# EAGLE design digitizer (EAGLE 8.0.1)

## Sheet 1 of 2
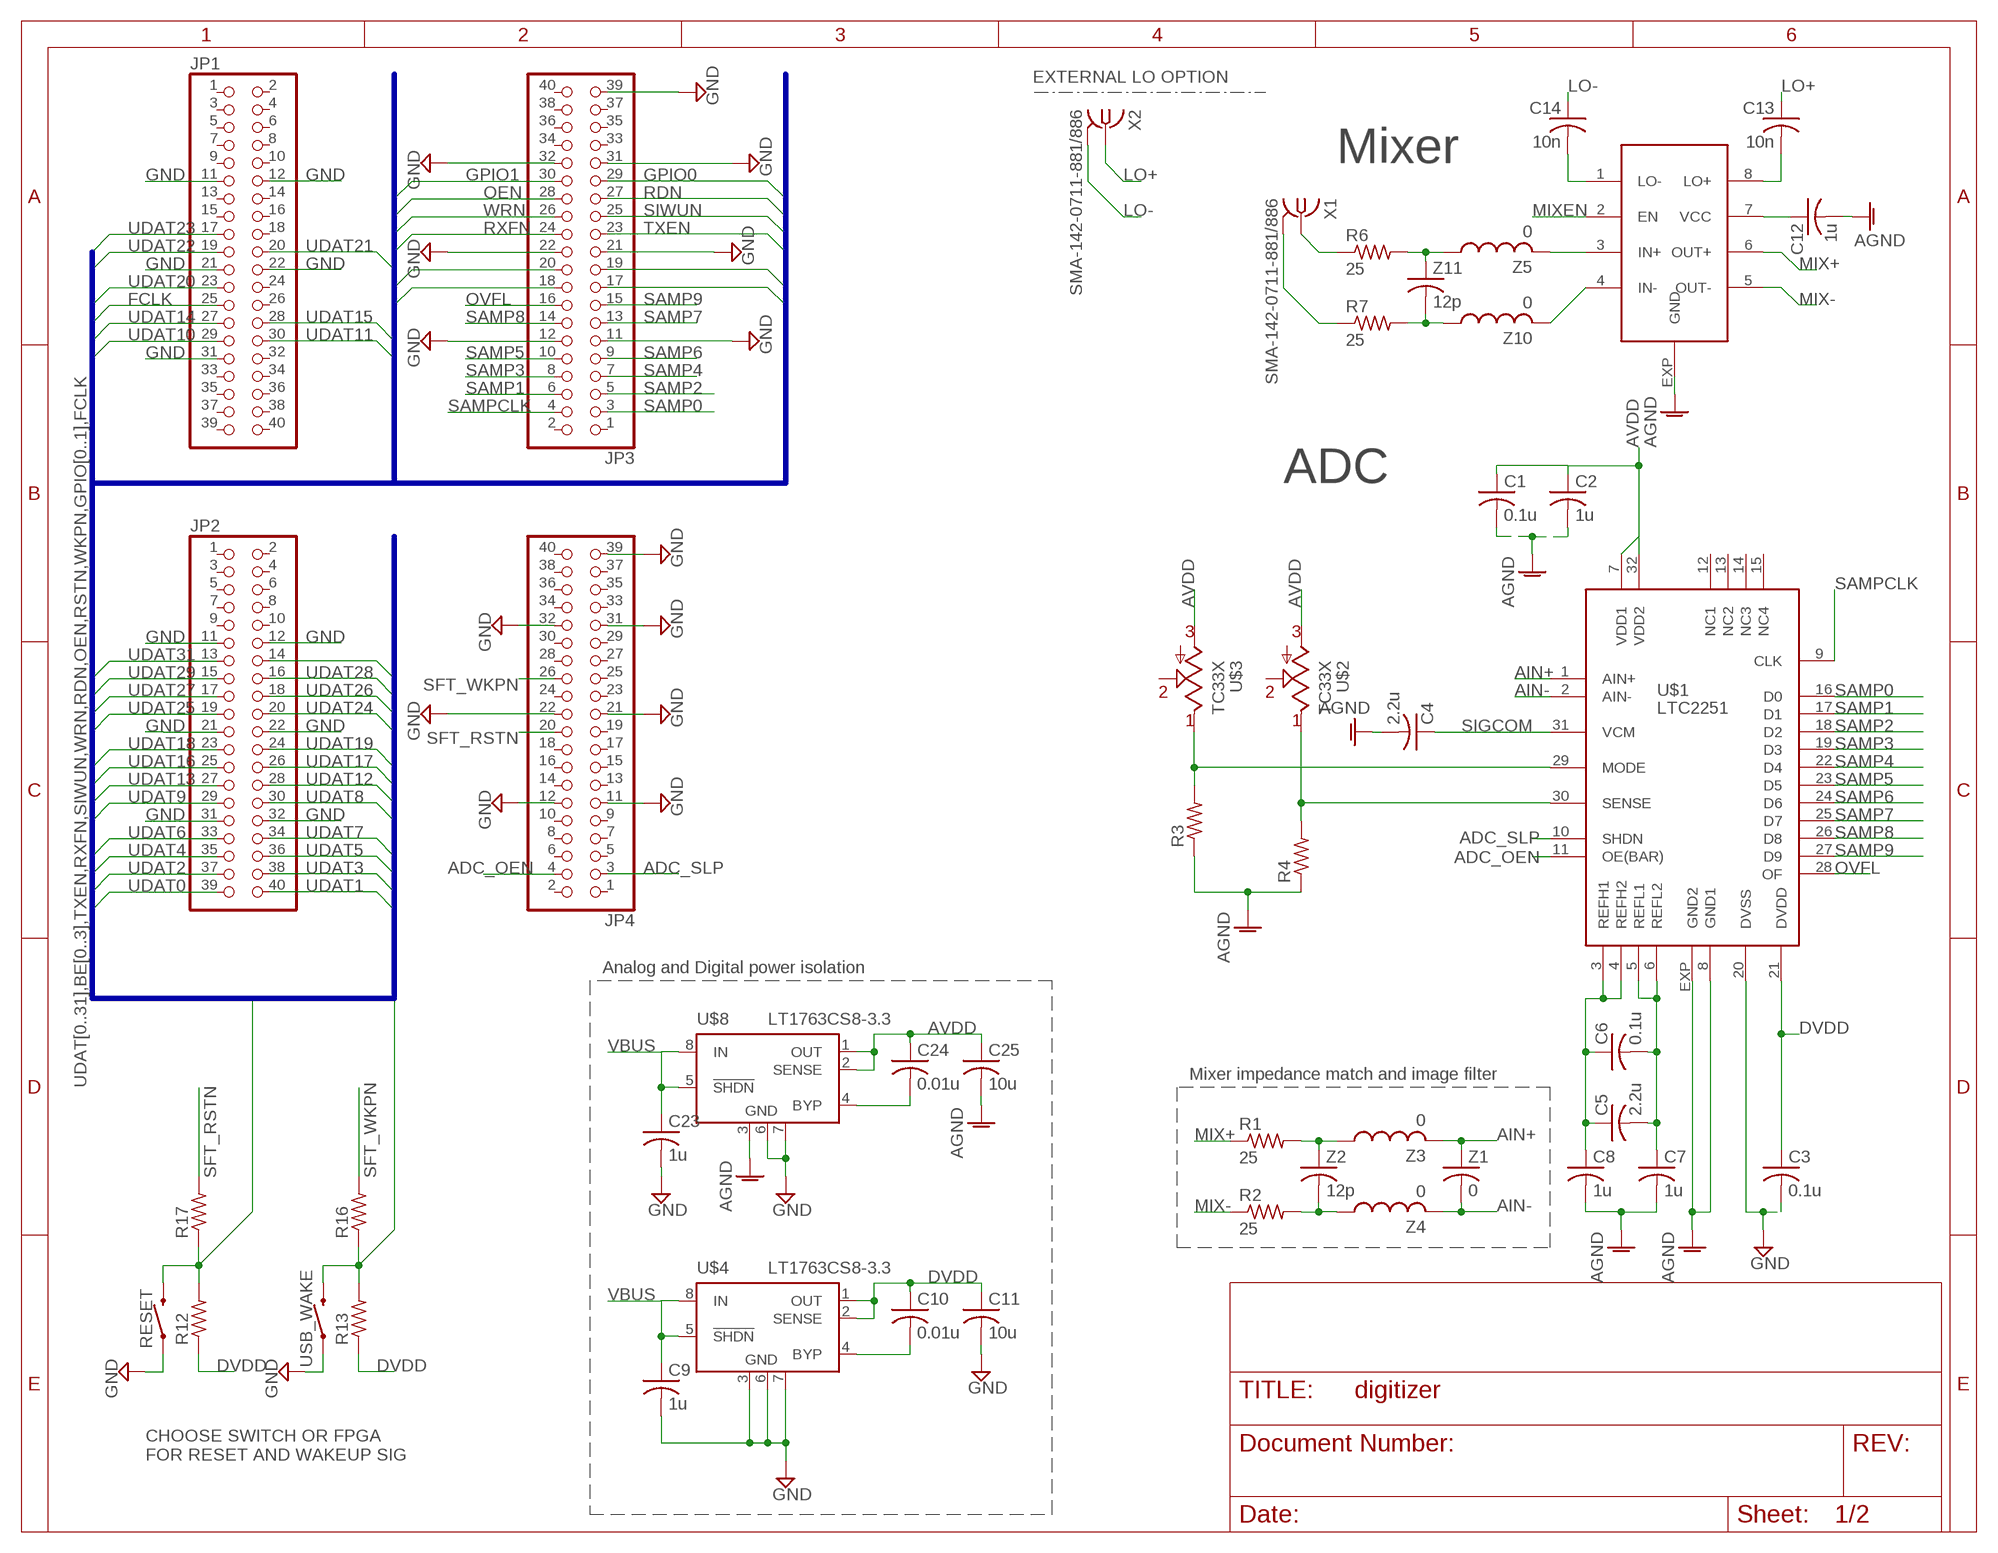
[diagram p0: schematic, sheet 1]

### Parts
C1  0.1u  C-USC0402  [C0402]
C2  1u  C-USC0402  [C0402]
C3  0.1u  C-USC0402  [C0402]
C4  2.2u  C-USC0402  [C0402]
C5  2.2u  C-USC0402  [C0402]
C6  0.1u  C-USC0402  [C0402]
C7  1u  C-USC0402  [C0402]
C8  1u  C-USC0402  [C0402]
C9  1u  C-USC0402  [C0402]
C10  0.01u  C-USC0402  [C0402]
C11  10u  C-USC0402  [C0402]
C12  1u  C-USC0402  [C0402]
C13  10n  C-USC0402  [C0402]
C14  10n  C-USC0402  [C0402]
C23  1u  C-USC0402  [C0402]
C24  0.01u  C-USC0402  [C0402]
C25  10u  C-USC0402  [C0402]
JP1  PINHD-2X20  [2X20]
JP2  PINHD-2X20  [2X20]
JP3  PINHD-2X20  [2X20]
JP4  PINHD-2X20  [2X20]
R1  25  R-US_R0402  [R0402]
R2  25  R-US_R0402  [R0402]
R3  R-US_R0402  [R0402]
R4  R-US_R0402  [R0402]
R6  25  R-US_R0402  [R0402]
R7  25  R-US_R0402  [R0402]
R12  R-US_R0402  [R0402]
R13  R-US_R0402  [R0402]
R16  R-US_R0402  [R0402]
R17  R-US_R0402  [R0402]
RESET  MOMENTARY-SWITCH-SPST-SMD-6.0X3.5MM  [TACTILE_SWITCH_SMD_6.0X3.5MM]
U$1  LTC2251  [HVQFN32]
U$2  TC33X  [SC59-POT]
U$3  TC33X  [SC59-POT]
U$4  LT1763CS8-3.3  [SOIC8]
U$5  LT5560  [DFN8-3X3]
U$8  LT1763CS8-3.3  [SOIC8]
USB_WAKE  MOMENTARY-SWITCH-SPST-SMD-6.0X3.5MM  [TACTILE_SWITCH_SMD_6.0X3.5MM]
X1  SMA-142-0711-881/886  [J502-ND-142-0711-881/886]
X2  SMA-142-0711-881/886  [J502-ND-142-0711-881/886]
Z1  0  C-USC0402  [C0402]
Z2  12p  C-USC0402  [C0402]
Z3  0  L-US0402  [R0402]
Z4  0  L-US0402  [R0402]
Z5  0  L-US0402  [R0402]
Z10  0  L-US0402  [R0402]
Z11  12p  C-USC0402  [C0402]

### Nets
ADC_OEN: JP4.4 U$1.11(OE(BAR))
ADC_SLP: JP4.3 U$1.10(SHDN)
AGND: C1.2 C2.2 C4.2 C7.2 C8.2 C12.2 C25.2 R3.1 R4.1 U$1.8(GND1) U$1.EXP(GND2) U$5.EXP(GND) U$8.3(GND)
AIN+: U$1.1(AIN+) Z1.1 Z3.2
AIN-: U$1.2(AIN-) Z1.2 Z4.2
AVDD: C1.1 C2.1 C24.1 C25.1 U$1.7(VDD1) U$1.32(VDD2) U$2.3 U$3.3 U$8.1(OUT) U$8.2(SENSE)
BE0: JP3.18 ; also sheet 2
BE1: JP3.17 ; also sheet 2
BE2: JP3.20 ; also sheet 2
BE3: JP3.19 ; also sheet 2
DVDD: C3.1 C10.1 C11.1 R12.1 R13.1 U$1.21(DVDD) U$4.1(OUT) U$4.2(SENSE) ; also sheet 2
FCLK: JP1.25 ; also sheet 2
GND: C3.2 C9.2 C11.2 C23.2 JP1.11 JP1.12 JP1.21 JP1.22 JP1.31 JP2.11 JP2.12 JP2.21 JP2.22 JP2.31 JP2.32 JP3.11 JP3.12 JP3.21 JP3.22 JP3.31 JP3.32 JP3.39 JP4.11 JP4.12 JP4.21 JP4.22 JP4.31 JP4.32 RESET.1 U$1.20(DVSS) U$4.3(GND) U$4.6(GND) U$4.7(GND) U$8.6(GND) U$8.7(GND) USB_WAKE.1 ; also sheet 2
GPIO0: JP3.29 ; also sheet 2
GPIO1: JP3.30 ; also sheet 2
LO+: C13.1 X2.1
LO-: C14.1 X2.G@1 X2.G@2 X2.G@3 X2.G@4
MIX+: R1.1 U$5.6(OUT+)
MIX-: R2.1 U$5.5(OUT-)
MIXEN: U$5.2(EN)
N$1: R7.1 X1.G@1 X1.G@2 X1.G@3 X1.G@4
N$2: C5.1 C6.1 C8.1 U$1.3(REFH1) U$1.4(REFH2)
N$3: C5.2 C6.2 C7.1 U$1.5(REFL1) U$1.6(REFL2)
N$4: R3.2 U$1.29(MODE) U$3.1
N$5: R4.2 U$1.30(SENSE) U$2.1
N$6: R1.2 Z2.1 Z3.1
N$7: R2.2 Z2.2 Z4.1
N$9: C10.2 U$4.4(BYP)
N$10: R6.1 X1.1
N$16: C24.2 U$8.4(BYP)
N$20: C12.1 U$5.7(VCC)
N$21: C14.2 U$5.1(LO-)
N$22: C13.2 U$5.8(LO+)
N$23: R6.2 Z5.1 Z11.1
N$24: U$5.3(IN+) Z5.2
N$25: U$5.4(IN-) Z10.2
N$26: R7.2 Z10.1 Z11.2
OEN: JP3.28 ; also sheet 2
OVFL: JP3.16 U$1.28(OF)
RDN: JP3.27 ; also sheet 2
RSTN: R12.2 R17.1 RESET.2 ; also sheet 2
RXFN: JP3.24 ; also sheet 2
SAMP0: JP3.3 U$1.16(D0)
SAMP1: JP3.6 U$1.17(D1)
SAMP2: JP3.5 U$1.18(D2)
SAMP3: JP3.8 U$1.19(D3)
SAMP4: JP3.7 U$1.22(D4)
SAMP5: JP3.10 U$1.23(D5)
SAMP6: JP3.9 U$1.24(D6)
SAMP7: JP3.13 U$1.25(D7)
SAMP8: JP3.14 U$1.26(D8)
SAMP9: JP3.15 U$1.27(D9)
SAMPCLK: JP3.4 U$1.9(CLK)
SFT_RSTN: JP4.20 R17.2
SFT_WKPN: JP4.26 R16.2
SIGCOM: C4.1 U$1.31(VCM)
SIWUN: JP3.25 ; also sheet 2
TXEN: JP3.23 ; also sheet 2
UDAT0: JP2.39 ; also sheet 2
UDAT1: JP2.40 ; also sheet 2
UDAT2: JP2.37 ; also sheet 2
UDAT3: JP2.38 ; also sheet 2
UDAT4: JP2.35 ; also sheet 2
UDAT5: JP2.36 ; also sheet 2
UDAT6: JP2.33 ; also sheet 2
UDAT7: JP2.34 ; also sheet 2
UDAT8: JP2.30 ; also sheet 2
UDAT9: JP2.29 ; also sheet 2
UDAT10: JP1.29 ; also sheet 2
UDAT11: JP1.30 ; also sheet 2
UDAT12: JP2.28 ; also sheet 2
UDAT13: JP2.27 ; also sheet 2
UDAT14: JP1.27 ; also sheet 2
UDAT15: JP1.28 ; also sheet 2
UDAT16: JP2.25 ; also sheet 2
UDAT17: JP2.26 ; also sheet 2
UDAT18: JP2.23 ; also sheet 2
UDAT19: JP2.24 ; also sheet 2
UDAT20: JP1.23 ; also sheet 2
UDAT21: JP1.20 ; also sheet 2
UDAT22: JP1.19 ; also sheet 2
UDAT23: JP1.17 ; also sheet 2
UDAT24: JP2.20 ; also sheet 2
UDAT25: JP2.19 ; also sheet 2
UDAT26: JP2.18 ; also sheet 2
UDAT27: JP2.17 ; also sheet 2
UDAT28: JP2.16 ; also sheet 2
UDAT29: JP2.15 ; also sheet 2
UDAT30: JP2.14 ; also sheet 2
UDAT31: JP2.13 ; also sheet 2
VBUS: C9.1 C23.1 U$4.5(!SHDN) U$4.8(IN) U$8.5(!SHDN) U$8.8(IN) ; also sheet 2
WKPN: R13.2 R16.1 USB_WAKE.2 ; also sheet 2
WRN: JP3.26 ; also sheet 2
Unconnected: JP1.1 JP1.2 JP1.3 JP1.4 JP1.5 JP1.6 JP1.7 JP1.8 JP1.9 JP1.10 JP1.13 JP1.14 JP1.15 JP1.16 JP1.18 JP1.24 JP1.26 JP1.32 JP1.33 JP1.34 JP1.35 JP1.36 JP1.37 JP1.38 JP1.39 JP1.40 JP2.1 JP2.2 JP2.3 JP2.4 JP2.5 JP2.6 JP2.7 JP2.8 JP2.9 JP2.10 JP3.1 JP3.2 JP3.33 JP3.34 JP3.35 JP3.36 JP3.37 JP3.38 JP3.40 JP4.1 JP4.2 JP4.5 JP4.6 JP4.7 JP4.8 JP4.9 JP4.10 JP4.13 JP4.14 JP4.15 JP4.16 JP4.17 JP4.18 JP4.19 JP4.23 JP4.24 JP4.25 JP4.27 JP4.28 JP4.29 JP4.30 JP4.33 JP4.34 JP4.35 JP4.36 JP4.37 JP4.38 JP4.39 JP4.40 U$1.12(NC1) U$1.13(NC2) U$1.14(NC3) U$1.15(NC4) U$2.2 U$3.2

### Buses
UDAT[0..31],BE[0..3],TXEN,RXFN,SIWUN,WRN,RDN,OEN,RSTN,WKPN,GPIO[0..1],FCLK

### Notes on the sheet
- EXTERNAL LO OPTION
- Mixer
- ADC
- Analog and Digital power isolation
- Mixer impedance match and image filter
- CHOOSE SWITCH OR FPGA
  FOR RESET AND WAKEUP SIG

## Sheet 2 of 2
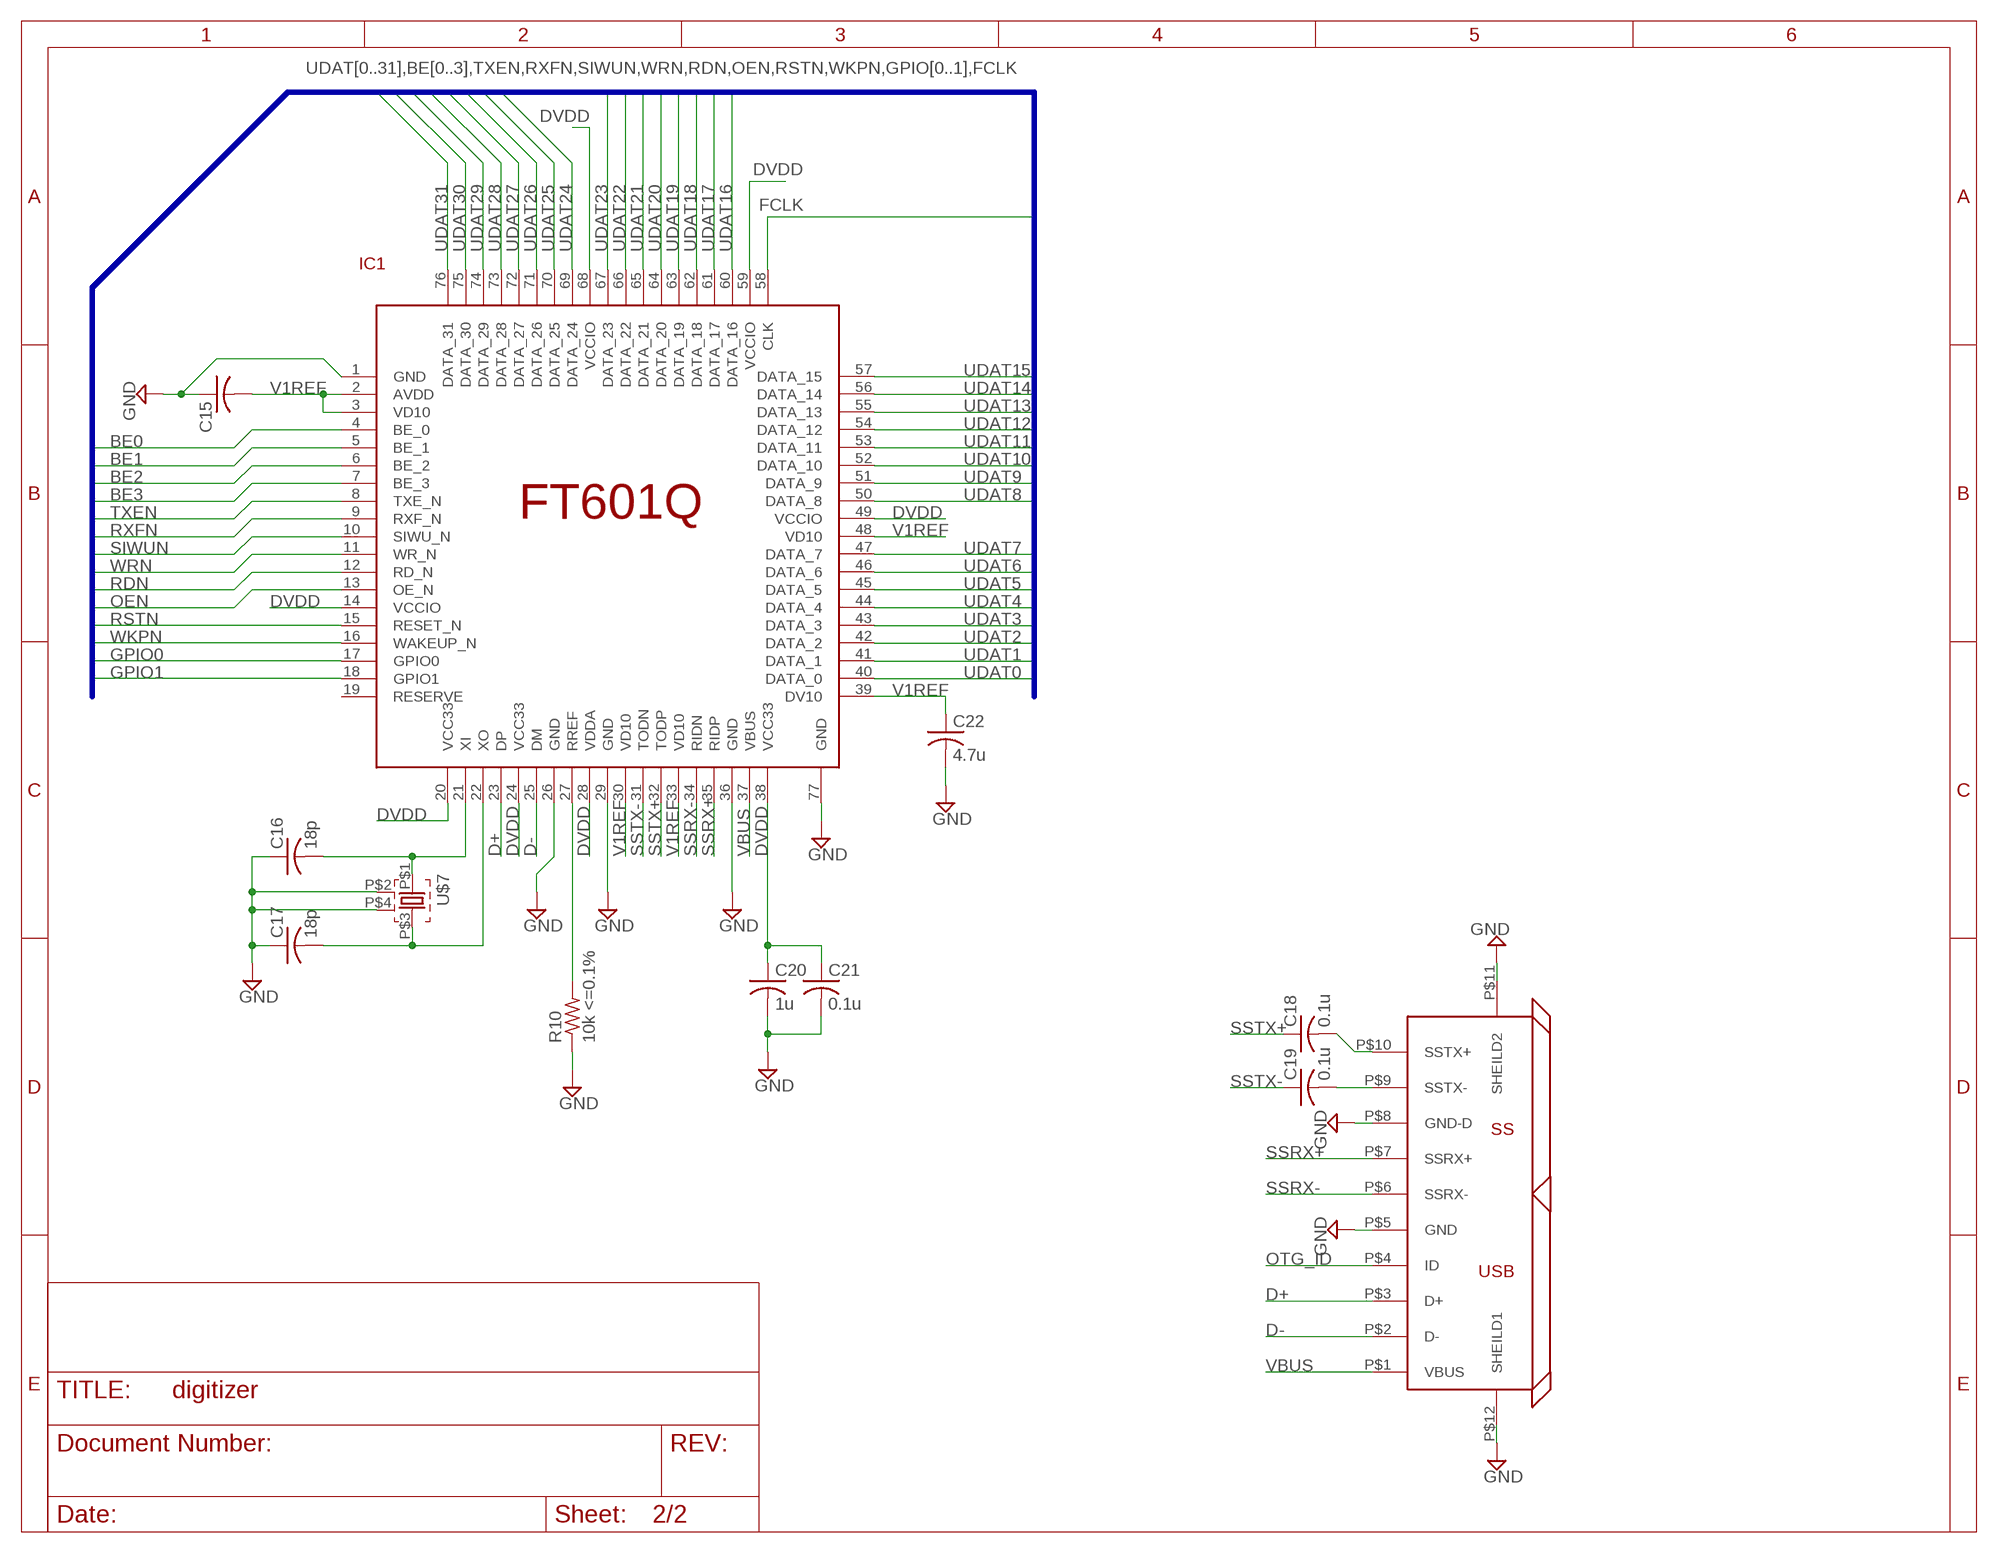
[diagram p1: schematic, sheet 2]

### Parts
C15  C-USC0402  [C0402]
C16  18p  C-USC0402  [C0402]
C17  18p  C-USC0402  [C0402]
C18  0.1u  C-USC0402  [C0402]
C19  0.1u  C-USC0402  [C0402]
C20  1u  C-USC0402  [C0402]
C21  0.1u  C-USC0402  [C0402]
C22  4.7u  C-USC0402  [C0402]
IC1  FT601QQFN76  [QFN76]
R10  10k <=0.1%  R-US_R0402  [R0402]
U$6  USB3.0  [USB-MICROB-3.0]
U$7  CX3225SB_UKY1C-H1-16357-0045  [UKY1C-H1-16357-0045]

### Nets
BE0: IC1.4(BE_0) ; also sheet 1
BE1: IC1.5(BE_1) ; also sheet 1
BE2: IC1.6(BE_2) ; also sheet 1
BE3: IC1.7(BE_3) ; also sheet 1
D+: IC1.23(DP) U$6.P$3(D+)
D-: IC1.25(DM) U$6.P$2(D-)
DVDD: C20.1 C21.1 IC1.14(VCCIO) IC1.20(VCC33) IC1.24(VCC33) IC1.28(VDDA) IC1.38(VCC33) IC1.49(VCCIO) IC1.59(VCCIO) IC1.68(VCCIO) ; also sheet 1
FCLK: IC1.58(CLK) ; also sheet 1
GND: C15.1 C16.1 C17.1 C20.2 C21.2 C22.2 IC1.1(GND) IC1.26(GND) IC1.29(GND) IC1.36(GND) IC1.77(GND) R10.1 U$6.P$5(GND) U$6.P$8(GND-D) U$6.P$11(SHEILD2) U$6.P$12(SHEILD1) U$7.P$2 U$7.P$4 ; also sheet 1
GPIO0: IC1.17(GPIO0) ; also sheet 1
GPIO1: IC1.18(GPIO1) ; also sheet 1
N$11: C16.2 IC1.21(XI) U$7.P$1
N$12: C17.2 IC1.22(XO) U$7.P$3
N$13: IC1.27(RREF) R10.2
N$14: C18.2 U$6.P$10(SSTX+)
N$15: C19.2 U$6.P$9(SSTX-)
OEN: IC1.13(OE_N) ; also sheet 1
OTG_ID: U$6.P$4(ID)
RDN: IC1.12(RD_N) ; also sheet 1
RSTN: IC1.15(RESET_N) ; also sheet 1
RXFN: IC1.9(RXF_N) ; also sheet 1
SIWUN: IC1.10(SIWU_N) ; also sheet 1
SSRX+: IC1.35(RIDP) U$6.P$7(SSRX+)
SSRX-: IC1.34(RIDN) U$6.P$6(SSRX-)
SSTX+: C18.1 IC1.32(TODP)
SSTX-: C19.1 IC1.31(TODN)
TXEN: IC1.8(TXE_N) ; also sheet 1
UDAT0: IC1.40(DATA_0) ; also sheet 1
UDAT1: IC1.41(DATA_1) ; also sheet 1
UDAT2: IC1.42(DATA_2) ; also sheet 1
UDAT3: IC1.43(DATA_3) ; also sheet 1
UDAT4: IC1.44(DATA_4) ; also sheet 1
UDAT5: IC1.45(DATA_5) ; also sheet 1
UDAT6: IC1.46(DATA_6) ; also sheet 1
UDAT7: IC1.47(DATA_7) ; also sheet 1
UDAT8: IC1.50(DATA_8) ; also sheet 1
UDAT9: IC1.51(DATA_9) ; also sheet 1
UDAT10: IC1.52(DATA_10) ; also sheet 1
UDAT11: IC1.53(DATA_11) ; also sheet 1
UDAT12: IC1.54(DATA_12) ; also sheet 1
UDAT13: IC1.55(DATA_13) ; also sheet 1
UDAT14: IC1.56(DATA_14) ; also sheet 1
UDAT15: IC1.57(DATA_15) ; also sheet 1
UDAT16: IC1.60(DATA_16) ; also sheet 1
UDAT17: IC1.61(DATA_17) ; also sheet 1
UDAT18: IC1.62(DATA_18) ; also sheet 1
UDAT19: IC1.63(DATA_19) ; also sheet 1
UDAT20: IC1.64(DATA_20) ; also sheet 1
UDAT21: IC1.65(DATA_21) ; also sheet 1
UDAT22: IC1.66(DATA_22) ; also sheet 1
UDAT23: IC1.67(DATA_23) ; also sheet 1
UDAT24: IC1.69(DATA_24) ; also sheet 1
UDAT25: IC1.70(DATA_25) ; also sheet 1
UDAT26: IC1.71(DATA_26) ; also sheet 1
UDAT27: IC1.72(DATA_27) ; also sheet 1
UDAT28: IC1.73(DATA_28) ; also sheet 1
UDAT29: IC1.74(DATA_29) ; also sheet 1
UDAT30: IC1.75(DATA_30) ; also sheet 1
UDAT31: IC1.76(DATA_31) ; also sheet 1
V1REF: C15.2 C22.1 IC1.2(AVDD) IC1.3(VD10) IC1.30(VD10) IC1.33(VD10) IC1.39(DV10) IC1.48(VD10)
VBUS: IC1.37(VBUS) U$6.P$1(VBUS) ; also sheet 1
WKPN: IC1.16(WAKEUP_N) ; also sheet 1
WRN: IC1.11(WR_N) ; also sheet 1
Unconnected: IC1.19(RESERVE)

### Buses
UDAT[0..31],BE[0..3],TXEN,RXFN,SIWUN,WRN,RDN,OEN,RSTN,WKPN,GPIO[0..1],FCLK

## Library data of the parts
C1-C14 C16-C25 Z1 Z2 Z11 = resistor:C-US: CAPACITOR, American symbol
C15 = rcl:C-US: CAPACITOR, American symbol
IC1 = lt_ftdi_and_more:FT601Q
JP1-JP4 = pinhead:PINHD-2X20: PIN HEADER
R1-R4 R6 R7 R10 R12 R13 R16 R17 = resistor:R-US_: RESISTOR, American symbol
RESET USB_WAKE = SparkFun-Switches:MOMENTARY-SWITCH-SPST: Momentary Switch (Pushbutton) - SPST Normally-open (NO) SPST momentary switches (buttons, pushbuttons). Variants PTH-12MM - 12mm square, through-hole Momentary Pushbutton Switch - 12mm Square <https://www.sparkfun.com/products/9190> (COM-09190) PTH-6.0MM, PTH-6.0MM-KIT - 6.0mm square, through-hole Mini Pushbutton Switch <https://www.sparkfun.com/products/97> (COM-00097) KIT package intended for soldering kit's - only one side of pads' copper is exposed. PTH-RIGHT-ANGLE-KIT - Right-angle, through-hole Right Angle Tactile Button <https://www.sparkfun.com/products/10791> - Used on SparkFun BigTime Watch Kit <https://www.sparkfun.com/products/11734> SMD-12MM - 12mm square, surface-mount Tactile Button - SMD (12mm) <https://www.sparkfun.com/products/12993> (COM-12993) Used on SparkFun PicoBoard <https://www.sparkfun.com/products/11888> SMD-4.5MM - 4.5mm Square Trackball Switch Used on SparkFun Blackberry Trackballer Breakout <https://www.sparkfun.com/products/13169> SMD-4.6MMX2.8MM - 4.60mm x 2.80mm, surface mount Used on SparkFun SAMD21 Mini Breakout <https://www.sparkfun.com/products/13664> SMD-5.2MM, SMD-5.2-REDUNDANT - 5.2mm square, surface-mount Mini Pushbutton Switch - SMD <https://www.sparkfun.com/products/8720> (COM-08720) Used on Arduino Pro Mini <https://www.sparkfun.com/products/11114> REDUNDANT package connects both switch circuits together SMD-6.0X3.5MM - 6.0 x 3.5mm, surface mount Momentary Reset Switch SMD <https://www.sparkfun.com/products/8229> (COM-08229) SMD-6.2MM-TALL - 6.2mm square, surface mount Tactile Button - SMD (6mm) <https://www.sparkfun.com/products/12992> Used on SparkFun Digital Sandbox <https://www.sparkfun.com/products/12651> SMD-RIGHT-ANGLE - Right-angle, surface mount Used on SparkFun Block for Intel® Edison - Arduino <https://www.sparkfun.com/products/13036>; PROD_ID: SWCH-00815; SF_SKU: COM-08229
U$1 = components:LTC2251: LTC2251 125MSPS Pipelined ADC
U$2 U$3 = components:TC33X: Wiper pots
U$4 U$8 = linear-technology:LT1763CS8: 500mA, Low Noise, LDO Micropower Regulators Source: http://cds.linear.com/docs/Datasheet/1763ff.pdf; MPN: LT1763CS8-3.3; OC_FARNELL: 1273617; OC_NEWARK: 57M6055
U$5 = components:LT5560
U$6 = components:USB3.0
U$7 = components:CX3225SB_UKY1C-H1-16357-0045
X1 X2 = con-coax:SMA-: SMA 50 Ohm End Launch Jack Receptacle - Round Contact Johnson Components Source: www.johnsoncomponents.com .. J502-ND.pdf; MF: JOHNSON COMPONENTS; MPN: 142-0711-881; OC_FARNELL: unknown; OC_NEWARK: 50B4464
Z3-Z5 Z10 = components:L-US

## Board
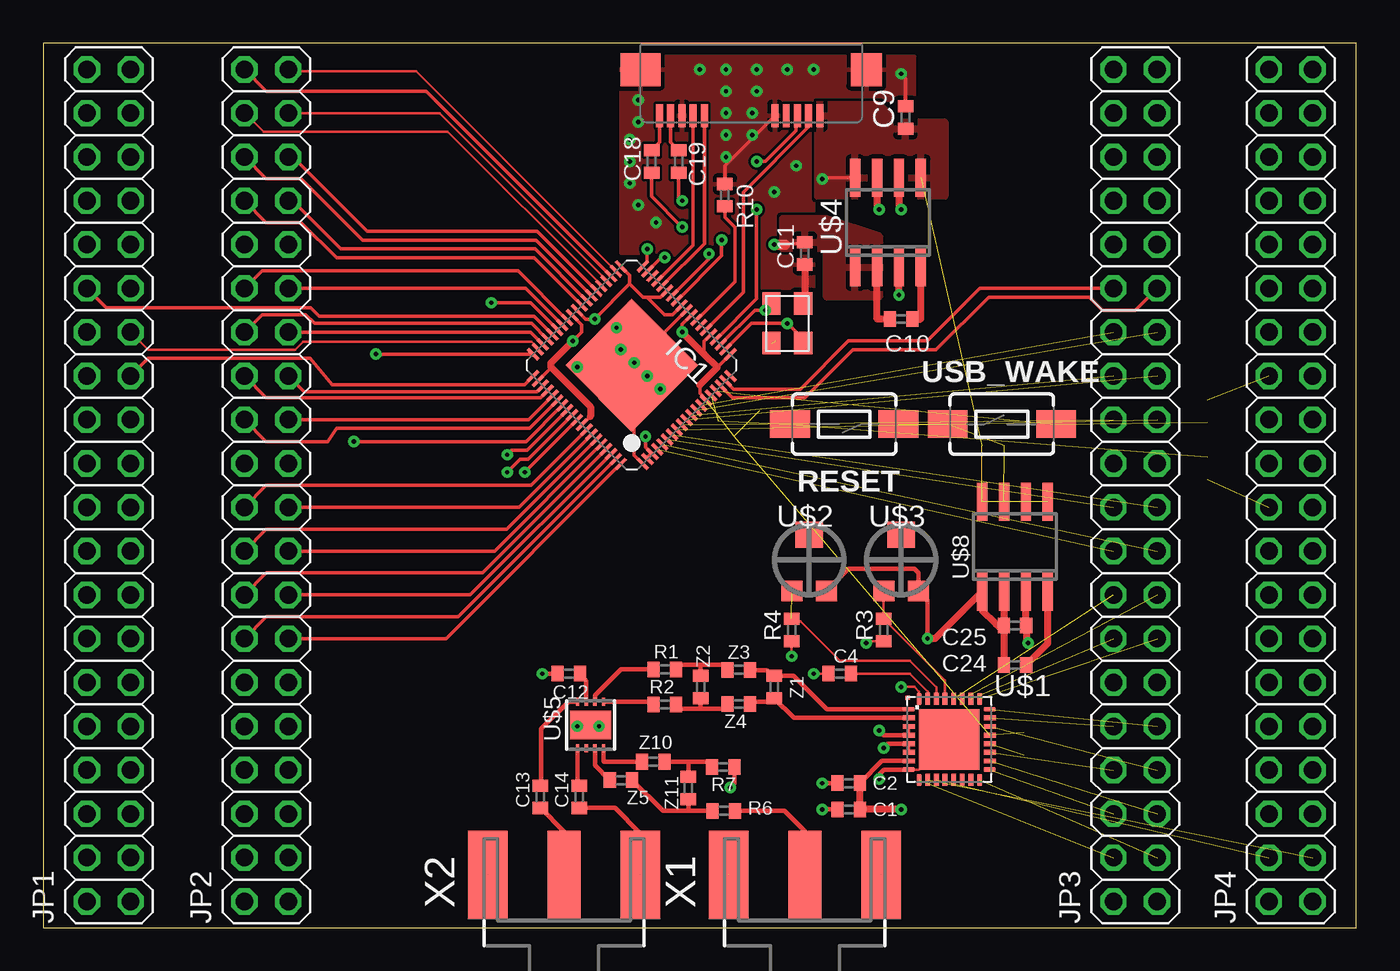
[diagram p2: board, top side]
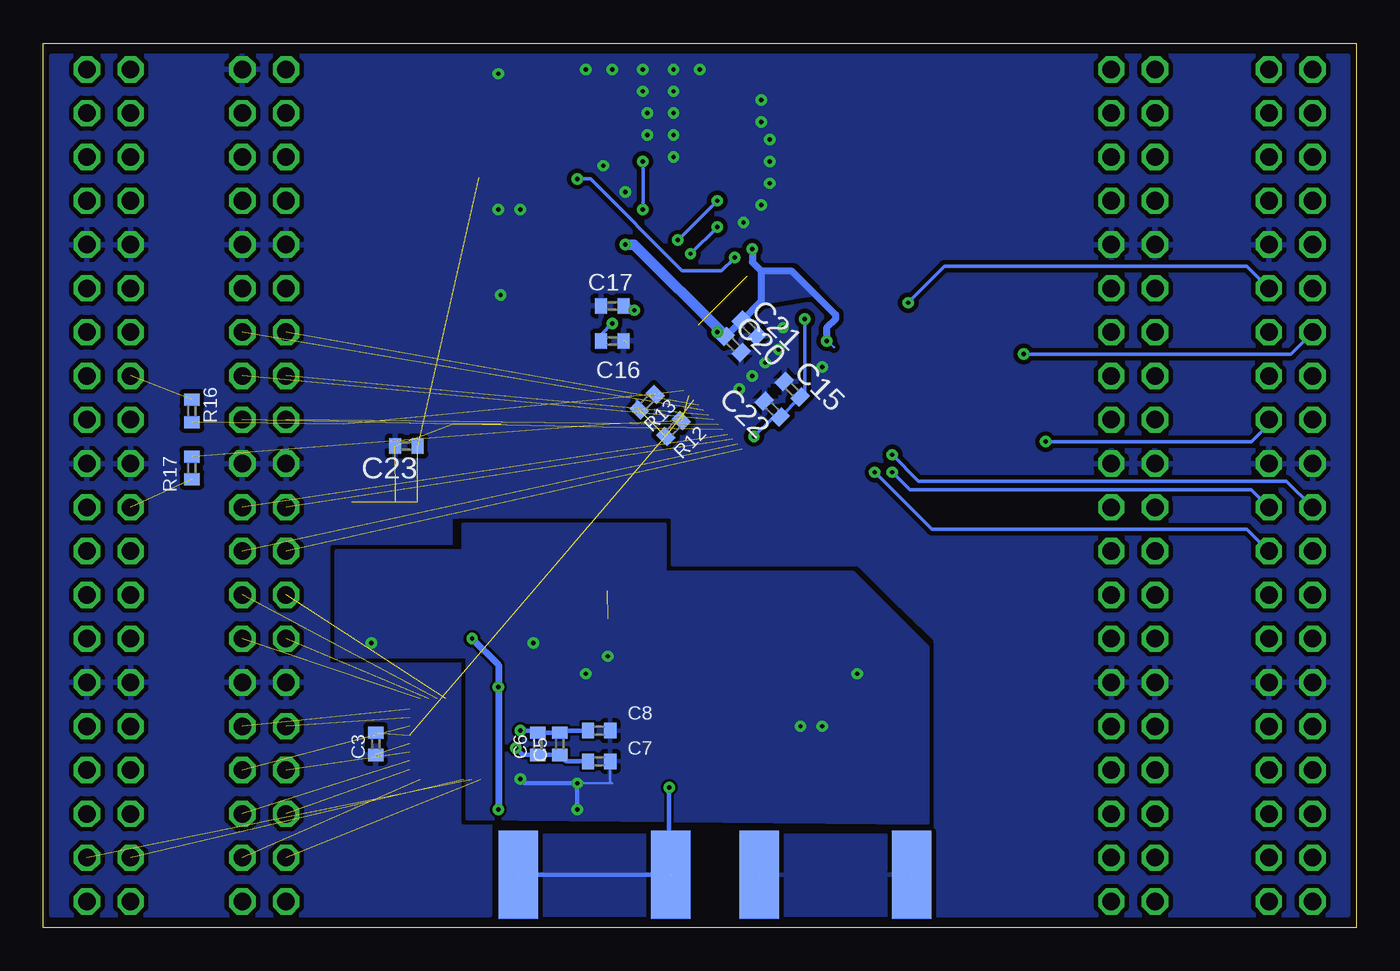
[diagram p3: board, bottom side, seen from below]

Size 76.2 x 51.31 mm. Coordinates in mm from the lower left corner, seen from the top.
Outline: 0,0 76.2,0 76.2,51.31 0,51.31 0,0
Copper layers (1*16): Top 0.035mm / dielectric 1.5mm / Bottom 0.035mm
Design rules "default *": minimum track width 6mil, minimum drill 10mil, track to track 6mil, track to pad 6mil, pad to pad 6mil, via to via 6mil, smd to smd 6mil, copper to edge 12mil, drill to drill 12mil, minimum pad ring 8mil, minimum via ring 8mil, stop-mask expansion 4mil, vias tented up to drill 0mil, thermal gap 10mil

### Footprints (pad centres in the part's own frame; a part is rotated, then mirrored left to right if it is on the bottom)
C0402 = smd 0.7 x 0.9: 1 -0.65,0; 2 0.65,0
QFN76 = smd 0.84 x 0.203: 1 -4.5,3.598; 2 -4.5,3.198; 3 -4.5,2.798; 4 -4.5,2.398; 5 -4.5,1.998; 6 -4.5,1.598; 7 -4.5,1.198; 8 -4.5,0.798; 9 -4.5,0.398; 10 -4.5,-0.002; 11 -4.5,-0.402; 12 -4.5,-0.802; 13 -4.5,-1.202; 14 -4.5,-1.602; 15 -4.5,-2.002; 16 -4.5,-2.402; 17 -4.5,-2.802; 18 -4.5,-3.202; 19 -4.5,-3.602; 39 4.5,-3.602; 40 4.5,-3.202; 41 4.5,-2.802; 42 4.5,-2.402; 43 4.5,-2.002; 44 4.5,-1.602; 45 4.5,-1.202; 46 4.5,-0.802; 47 4.5,-0.402; 48 4.5,-0.002; 49 4.5,0.398; 50 4.5,0.798; 51 4.5,1.198; 52 4.5,1.598; 53 4.5,1.998; 54 4.5,2.398; 55 4.5,2.798; 56 4.5,3.198; 57 4.5,3.598 | smd 0.203 x 0.84: 20 -3.598,-4.5; 21 -3.198,-4.5; 22 -2.798,-4.5; 23 -2.398,-4.5; 24 -1.998,-4.5; 25 -1.598,-4.5; 26 -1.198,-4.5; 27 -0.798,-4.5; 28 -0.398,-4.5; 29 0.002,-4.5; 30 0.402,-4.5; 31 0.802,-4.5; 32 1.202,-4.5; 33 1.602,-4.5; 34 2.002,-4.5; 35 2.402,-4.5; 36 2.802,-4.5; 37 3.202,-4.5; 38 3.602,-4.5; 58 3.602,4.5; 59 3.202,4.5; 60 2.802,4.5; 61 2.402,4.5; 62 2.002,4.5; 63 1.602,4.5; 64 1.202,4.5; 65 0.802,4.5; 66 0.402,4.5; 67 0.002,4.5; 68 -0.398,4.5; 69 -0.798,4.5; 70 -1.198,4.5; 71 -1.598,4.5; 72 -1.998,4.5; 73 -2.398,4.5; 74 -2.798,4.5; 75 -3.198,4.5; 76 -3.598,4.5 | smd 5.45 x 5.45: 77 0,0
2X20 = drill 1.016 octagon: 1 -24.13,-1.27; 2 -24.13,1.27; 3 -21.59,-1.27; 4 -21.59,1.27; 5 -19.05,-1.27; 6 -19.05,1.27; 7 -16.51,-1.27; 8 -16.51,1.27; 9 -13.97,-1.27; 10 -13.97,1.27; 11 -11.43,-1.27; 12 -11.43,1.27; 13 -8.89,-1.27; 14 -8.89,1.27; 15 -6.35,-1.27; 16 -6.35,1.27; 17 -3.81,-1.27; 18 -3.81,1.27; 19 -1.27,-1.27; 20 -1.27,1.27; 21 1.27,-1.27; 22 1.27,1.27; 23 3.81,-1.27; 24 3.81,1.27; 25 6.35,-1.27; 26 6.35,1.27; 27 8.89,-1.27; 28 8.89,1.27; 29 11.43,-1.27; 30 11.43,1.27; 31 13.97,-1.27; 32 13.97,1.27; 33 16.51,-1.27; 34 16.51,1.27; 35 19.05,-1.27; 36 19.05,1.27; 37 21.59,-1.27; 38 21.59,1.27; 39 24.13,-1.27; 40 24.13,1.27
R0402 = smd 0.7 x 0.9: 1 -0.65,0; 2 0.65,0
TACTILE_SWITCH_SMD_6.0X3.5MM = smd 2.3 x 1.6: 1 -3.15,0; 2 3.15,0
HVQFN32 = smd 0.7 x 0.28: 1 -2.35,1.75; 2 -2.35,1.25; 3 -2.35,0.75; 4 -2.35,0.25; 5 -2.35,-0.25; 6 -2.35,-0.75; 7 -2.35,-1.25; 8 -2.35,-1.75; 17 2.35,-1.75; 18 2.35,-1.25; 19 2.35,-0.75; 20 2.35,-0.25; 21 2.35,0.25; 22 2.35,0.75; 23 2.35,1.25; 24 2.35,1.75 | smd 0.28 x 0.7: 9 -1.75,-2.35; 10 -1.25,-2.35; 11 -0.75,-2.35; 12 -0.25,-2.35; 13 0.25,-2.35; 14 0.75,-2.35; 15 1.25,-2.35; 16 1.75,-2.35; 25 1.75,2.35; 26 1.25,2.35; 27 0.75,2.35; 28 0.25,2.35; 29 -0.25,2.35; 30 -0.75,2.35; 31 -1.25,2.35; 32 -1.75,2.35 | smd 3.5 x 3.5: EXP 0,0 | smd 0.25 x 0.25: M1 -2.415,2.415
SC59-POT = smd 1.2 x 1.2: 1 -1,-1.8; 3 1,-1.8 | smd 1.6 x 1.5: 2 0,1.45
SOIC8 = smd 0.6 x 2.2: 1 -1.905,-2.6; 2 -0.635,-2.6; 3 0.635,-2.6; 4 1.905,-2.6; 5 1.905,2.6; 6 0.635,2.6; 7 -0.635,2.6; 8 -1.905,2.6
DFN8-3X3 = smd 0.25 x 0.45: 1 -0.75,-1.35; 2 -0.25,-1.35; 3 0.25,-1.35; 4 0.75,-1.35; 5 0.75,1.35; 6 0.25,1.35; 7 -0.25,1.35; 8 -0.75,1.35 | smd 2.38 x 1.65: EXP 0,0
USB-MICROB-3.0 = smd 0.4 x 1.35: P$1 -1.3,0; P$2 -0.65,0; P$3 0,0; P$4 0.65,0; P$5 1.3,0; P$6 5.4,0; P$7 6.05,0; P$8 6.7,0; P$9 7.35,0; P$10 8,0 | smd 1.8 x 1.9: P$11 -4,-2.675 | smd 2.3 x 1.9: P$12 9.1,-2.675
UKY1C-H1-16357-0045 = smd 1.3 x 1.05: P$1 -1.15,-0.925; P$2 1.15,-0.925; P$3 1.15,0.925; P$4 -1.15,0.925
J502-ND-142-0711-881/886 = smd 5.08 x 1.905: 1 2.565,0 | smd 5.08 x 2.286: G@1 2.565,4.42; G@2 2.565,-4.42 | smd 5.08 x 2.286 bottom: G@3 2.565,4.42; G@4 2.565,-4.42

### Placement (x,y rotation side)
C1  46.74,6.86 180 top
C2  46.74,8.38 180 top
C3  56.9,10.67 270 bottom
C4  46.23,14.73 180 top
C5  46.23,10.67 270 bottom
C6  47.5,10.67 270 bottom
C7  43.94,9.65 0 bottom
C8  43.94,11.43 0 bottom
C9  50.04,46.99 90 top
C10  49.78,35.31 0 top
C11  44.2,39.12 270 top
C12  30.51,14.73 180 top
C13  28.85,7.59 90 top
C14  31.11,7.59 90 top
C15  32.74,31.23 315 bottom
C16  43.18,34.04 180 bottom
C17  43.18,36.07 0 bottom
C18  35.31,44.45 90 top
C19  36.88,44.45 90 top
C20  36.16,33.83 315 bottom
C21  35.22,34.78 315 bottom
C22  33.89,30.08 135 bottom
C23  55.12,27.94 180 bottom
C24  56.39,15.24 0 top
C25  56.39,17.53 0 top
IC1  34.15,32.63 135 top
JP1  3.81,25.65 90 top
JP2  12.95,25.65 90 top
JP3  63.37,25.65 90 top
JP4  72.39,25.65 90 top
R1  36.07,14.99 0 top
R2  36.07,12.95 0 top
R3  48.77,17.27 90 top
R4  43.43,17.27 90 top
R6  39.5,6.78 180 top
R7  39.47,9.32 180 top
R10  39.56,42.49 270 top
R12  39.62,28.96 45 bottom
R13  41.15,30.48 45 bottom
R16  67.56,29.97 90 bottom
R17  67.56,26.67 270 bottom
RESET  46.48,29.21 180 top
U$1  52.58,10.92 0 top
U$2  44.45,21.34 0 top
U$3  49.78,21.34 0 top
U$4  49.02,40.89 0 top
U$5  31.76,11.76 0 top
U$6  43.76,47.09 180 top
U$7  43.18,35.05 90 top
U$8  56.39,22.1 0 top
USB_WAKE  55.63,29.21 0 top
X1  44.2,0.51 90 top
X2  30.23,0.51 90 top
Z1  42.42,13.97 270 top
Z2  38.15,13.97 270 top
Z3  40.36,14.96 0 top
Z4  40.37,12.98 0 top
Z5  33.53,8.56 180 top
Z10  35.41,9.63 180 top
Z11  37.44,8.1 90 top

### Tracks (layer width: path | path; a pad name or v marks a point on that pad's centre or on a via)
ADC_OEN  (1 unrouted)
ADC_SLP  (1 unrouted)
AGND  (via drill 0.25)
  Top 0.152: R4.1 v43.43,15.75 | C4.2 v44.7,14.73 | R3.1 47.86,16.62 v47.75,16.51 | U$1.8 50.83,9.17 U$1.EXP | U$5.EXP 31.69,11.68 v30.99,11.68
  Top 0.203: 57.02,17.54 C25.2 | 57.04,16.51 v57.15,16.51
  Top 0.254: C2.2 v45.21,8.38 | C1.2 v45.21,6.86 | U$1.8 48.8,9.17 48.51,8.89 v48.51,8.64 | v28.96,14.73 C12.2
  Top 0.406: 57.02,17.54 U$8.3 | C25.2 57.04,16.51
  Bottom 0.152: v45.21,8.38 43.18,8.38 43.29,8.49 C7.2
  Bottom 0.254: v45.21,6.86 v45.21,8.38 48.26,8.38 v48.51,8.64
  other vias: 32.26,11.68
  pour Bottom: 24.89,6.1 51.56,6.35 51.56,15.75 59.18,15.75 59.18,21.84 51.82,21.84 51.82,23.37 40.13,23.37 40.13,20.57 29.21,20.57 24.89,16.26
AIN+
  Top 0.152: 41.1,14.94 Z3.2 | 42.32,14.63 Z1.1
  Top 0.254: 41.1,14.94 42.01,14.94 42.32,14.63 | Z1.1 43.55,14.62 45.49,12.67 U$1.1
AIN-
  Top 0.152: 42.16,13.11 42.32,13.26 Z1.2 | 41.1,13.11 Z4.2
  Top 0.254: 42.16,13.11 41.1,13.11 | Z1.2 43.57,12.17 U$1.2
AVDD  (via drill 0.25)
  Top 0.152: U$1.32 50.83,13.69 50.55,13.97 v49.78,13.97 | 51.31,19.01 U$3.3
  Top 0.203: U$8.2 55.74,19.48 | 54.48,18.41 U$8.1 | C25.1 55.67,17.6 55.3,17.6
  Top 0.254: U$1.7 48.68,9.67 C2.1 | v51.31,16.76 51.31,19.01 U$3.3 50.78,20.59 50.55,20.83 46.74,20.83 U$2.3
  Top 0.406: 55.74,19.48 C25.1 | C24.1 55.74,17.16 55.3,17.6 54.48,18.41 | C2.1 C1.1 v49.78,6.86 | U$8.1 51.75,16.76 v51.31,16.76
  Bottom 0.406: v51.31,16.76 49.78,15.24 v49.78,13.97 v49.78,6.86
BE0  (1 unrouted)
BE1  (1 unrouted)
BE2  (1 unrouted)
BE3  (1 unrouted)
D+  (via drill 0.25)
  Top 0.203: IC1.23 41.4,36.49 v41.4,41.66 | 43.69,47.02 U$6.P$3 43.69,47.02 | v41.4,44.45 41.91,44.45 43.69,46.23 43.69,47.02
  Bottom 0.203: v41.4,41.66 v41.4,44.45
D-
  Top 0.203: IC1.25 40.64,36.86 40.64,42.67 44.41,46.45 U$6.P$2
DVDD  (via drill 0.25)  (4 unrouted)
  Top 0.203: IC1.59 29.51,32.51 | 31.75,29.66 IC1.68 | IC1.49 31.24,34.98 31.24,34.54 v30.73,34.04 | IC1.38 35.05,38.62 v35.05,39.37 | IC1.28 37.08,35 v37.08,34.54 | IC1.20 39.12,32.51 | 38.1,31.49 38.1,30.99 38.47,30.62 IC1.14 | IC1.24 38.35,34 38.35,33.27 | 43.04,39.62 C11.1
  Top 0.305: 29.51,32.51 29.46,32.51
  Top 0.406: 31.75,29.66 31.75,30.23 29.46,32.51 29.46,32.77 v30.73,34.04 | C10.1 48.39,35.31 U$4.2 | 38.1,31.49 39.12,32.51 38.35,33.27 v37.08,34.54
  Top 0.61: C11.1 44.19,39.78 | v42.42,39.62 43.04,39.62
  Bottom 0.152: 30.33,33.68 30.63,33.98 v30.73,34.04 | 41.76,30.63 41.76,30.02 R13.1
  Bottom 0.203: 35.62,35.24 C21.1 | v37.08,34.54 36.83,34.28 C20.1 36.62,34.33
  Bottom 0.406: 35.62,35.24 34.54,36.32 34.54,38.1 | v35.05,39.37 35.05,38.61 34.54,38.1 | C21.1 35.68,35.22 C20.1 | 34.54,38.1 32.77,38.1 30.23,35.56 30.23,35.31 30.73,34.8 v30.73,34.04
  Bottom 0.61: 36.62,34.33 41.91,39.62 v42.42,39.62
  pour Bottom: 32.77,38.1 34.54,38.1 34.54,36.32 31.5,36.83
  pour Top: 42.93,39.37 42.93,41.15 45.47,41.15 48.51,40.13 48.51,36.58 45.47,36.58 45.47,39.37
FCLK
  Top 0.203: IC1.58 27.94,31.5 16.76,31.5 15.49,33.02 6.1,33.02 JP1.25
GND  (via drill 0.25)  (8 unrouted)
  Top 0.152: 36.12,34.59 36.12,33.83 35.66,33.38 IC1.77 v35.81,31.24 34.29,29.72 34.29,28.96 | 44.35,38.56 C11.2 | 48.31,41.6 v48.51,41.66 | 49.84,41.76 v49.78,41.66
  Top 0.203: IC1.1 34.29,27.41 34.29,28.96 | C20.2 34.96,32.63 IC1.77 34.78,32 v35.05,32 | 44.2,36.29 U$7.P$2 | IC1.29 36.12,34.59 36.07,34.54 | IC1.26 | U$6.P$5 39.56,44.18 R10.1 | C9.2 50.04,49.28 v49.78,49.53
  Top 0.406: v49.66,36.7 U$4.3 | C11.2 44.2,36.29 | U$4.7 48.39,41.78 v48.51,41.66 | U$4.6 49.66,41.78 v49.78,41.66
  other vias: 30.99,32.51 33.27,34.8 33.53,33.53 34.29,32.77 42.42,42.67 43.69,44.2 39.62,44.7 41.15,45.97 39.62,45.97 39.62,47.24 41.15,47.24 41.4,48.51 39.62,48.51 38.1,49.78 39.62,49.78 41.4,49.78 43.18,49.78 44.7,49.78 34.54,48.01 34.54,46.74 34.04,45.72 34.04,44.45 34.04,43.18 34.54,41.91 35.56,40.89
  pour Bottom (isolate 0.254, rank 2): 0.51,50.55 0.51,0.76 24.38,0.76 24.38,16.76 28.96,21.08 39.62,21.08 39.62,23.88 52.58,23.88 52.58,22.1 59.69,22.1 59.69,15.24 51.82,15.24 51.82,6.1 50.29,6.1 50.29,0.76 75.69,0.76 75.69,50.55
  pour Top (rank 3): 33.53,50.55 33.53,39.12 34.8,39.12 41.66,37.08 44.7,37.08 44.7,48.01 50.55,48.01 50.55,50.55
GPIO0
  Top 0.203: IC1.17 40.01,30.73 44.2,30.73 46.99,33.53 51.82,33.53 54.86,36.58 60.71,36.58 61.47,35.81 63.37,35.81 JP3.29
GPIO1
  Top 0.203: IC1.18 40.07,31.24 43.94,31.24 46.74,34.04 51.31,34.04 54.36,37.08 JP3.30
LO+
  Top 0.254: X2.1 30.23,5.57 C13.1
LO-  (2 unrouted)
  Top 0.254: X2.G@4 34.65,5.49 33.19,6.95 C14.1
  pour Bottom: 24.89,5.33 24.89,0.76 35.56,0.76 35.56,5.33
MIX+
  Top 0.254: U$5.6 32.01,13.47 33.53,14.99 R1.1
MIX-
  Top 0.152: 35.15,13.11 35.31,12.95 R2.1
  Top 0.254: 35.15,13.11 U$5.5
N$1  (via drill 0.25)  (2 unrouted)
  Top 0.254: R7.1 40.12,8.37 v39.88,8.13
  Bottom 0.254: X1.G@4 X1.G@3 39.88,3.17 v39.88,8.13
  pour Bottom: 38.86,5.33 38.86,0.76 49.53,0.76 49.53,5.33
N$2  (via drill 0.25)
  Top 0.152: U$1.3 U$1.4
  Top 0.254: U$1.4 48.77,11.17 v48.51,11.43
  Bottom 0.152: 47.61,11.43 C6.1 | C5.1 46.12,11.43
  Bottom 0.254: C6.1 C5.1 | v48.51,11.43 47.61,11.43 | 46.12,11.43 C8.1
N$3  (via drill 0.25)
  Top 0.152: U$1.6 U$1.5
  Top 0.254: U$1.5 49.03,10.67 v48.77,10.41
  Bottom 0.254: v48.77,10.41 48.37,10.02 C6.2 C5.2 45.86,9.65 C7.1
N$4
  Top 0.152: U$3.1 48.77,19.52 R3.2 52.33,14.36 U$1.29
N$5  (1 unrouted)
  Top 0.152: U$1.30 51.83,13.96 50.29,15.49 46.23,15.49 43.94,17.78 43.58,17.78 R4.2
N$6
  Top 0.254: R1.2 36.72,15.24 38.15,15.24 | Z3.1 arc90 39.43,15.24 38.15,15.24 | Z2.1 38.15,15.24
N$7
  Top 0.254: R2.2 36.97,12.7 38.15,12.7 | Z4.1 arc-90 39.44,12.7 38.15,12.7 | Z2.2 38.15,12.7
N$9
  Top 0.406: C10.2 50.93,35.31 U$4.4
N$10
  Top 0.254: R6.1 43,6.78 44.2,5.59 X1.1
N$11  (via drill 0.25)
  Top 0.203: IC1.21 41.1,35.05 v43.18,35.05 44.1,34.13 U$7.P$1
  Bottom 0.203: v43.18,35.05 43.83,34.4 C16.2
N$12  (via drill 0.25)
  Top 0.203: IC1.22 41.3,35.81 | 41.3,35.81 v41.91,35.81 | 41.3,35.81 41.87,35.81 arc90 U$7.P$3
  Bottom 0.203: v41.91,35.81 42.16,36.07 C17.2
N$13
  Top 0.203: IC1.27 40.13,37.48 40.13,40.64 39.56,41.22 R10.2
N$14
  Top 0.203: C18.2 35.76,45.56 U$6.P$10
N$15
  Top 0.203: C19.2 36.41,45.57 U$6.P$9
N$16
  Top 0.406: C24.2 58.29,16.5 U$8.4
N$20
  Top 0.152: 31.5,13.11 U$5.7 | 31.19,14.63 C12.1
  Top 0.254: 31.5,13.11 31.5,14.33 31.19,14.63
N$21
  Top 0.152: 31.01,10.39 U$5.1 | 31.01,8.38 C14.2
  Top 0.254: 31.01,8.38 31.01,10.39
N$22
  Top 0.152: 31.04,13.11 U$5.8 | 28.91,8.38 C13.2
  Top 0.254: U$5.8 30.48,13.11 28.91,11.53 28.91,8.38
N$23
  Top 0.254: 37.44,6.78 R6.2 | 37.44,6.78 35.96,6.78 Z5.1 | Z11.1 37.44,6.78
N$24
  Top 0.254: Z5.2 32.01,9.43 U$5.3
N$25
  Top 0.254: Z10.2 32.54,9.63 32.51,9.65 U$5.4
N$26
  Top 0.254: R7.2 38.52,9.63 37.44,9.63 | 37.44,9.63 Z10.1 | Z11.2 37.44,9.63
OEN  (1 unrouted)
OVFL  (1 unrouted)
RDN  (1 unrouted)
RSTN  (3 unrouted)
RXFN  (1 unrouted)
SAMP0  (1 unrouted)
SAMP1  (1 unrouted)
SAMP2  (1 unrouted)
SAMP3  (1 unrouted)
SAMP4  (1 unrouted)
SAMP5  (1 unrouted)
SAMP6  (1 unrouted)
SAMP7  (1 unrouted)
SAMP8  (1 unrouted)
SAMP9  (1 unrouted)
SAMPCLK  (1 unrouted)
SFT_RSTN  (1 unrouted)
SFT_WKPN  (1 unrouted)
SIGCOM
  Top 0.152: U$1.31 51.33,13.7 50.29,14.73 C4.1
SIWUN  (1 unrouted)
SSRX+
  Top 0.203: IC1.35 37.71,39.59 U$6.P$7
SSRX-
  Top 0.203: IC1.34 38.36,39.67 U$6.P$6
SSTX+  (via drill 0.25)
  Top 0.203: IC1.32 38.61,38.78 v38.63,39.09 | v37.08,40.64 35.31,42.42 C18.1
  Bottom 0.203: v38.63,39.09 v37.08,40.64
SSTX-  (via drill 0.25)
  Top 0.203: IC1.31 39.37,38.98 v39.37,39.88 | v37.08,42.16 36.88,42.37 C19.1
  Bottom 0.203: v39.37,39.88 v37.08,42.16
TXEN  (1 unrouted)
UDAT0
  Top 0.152: IC1.40 33.22,38.1 21.64,49.68 14.33,49.68 JP2.39
UDAT1
  Top 0.203: IC1.41 22.23,48.51 12.95,48.51 JP2.40
UDAT2
  Top 0.152: JP2.37 23.01,47.24 32.61,37.64 IC1.42
UDAT3
  Top 0.152: IC1.43 32.31,37.34 23.47,46.18 12.8,46.18 11.73,47.24 JP2.38
UDAT4
  Top 0.203: IC1.44 28.66,40.39 18.8,40.39 14.48,44.7 JP2.35
UDAT5
  Top 0.203: IC1.45 28.61,39.88 18.54,39.88 14.99,43.43 12.95,43.43 JP2.36
UDAT6
  Top 0.203: IC1.46 28.55,39.37 17.27,39.37 14.48,42.16 JP2.33
UDAT7
  Top 0.203: IC1.47 28.49,38.86 17.02,38.86 14.99,40.89 12.95,40.89 JP2.34
UDAT8
  Top 0.203: IC1.50 27.55,38.1 12.7,38.1 JP2.30
UDAT9
  Top 0.203: IC1.51 28,37.08 JP2.29
UDAT10  (via drill 0.25)
  Top 0.203: IC1.52 28.28,36.25 v26.01,36.25
  Bottom 0.203: v26.01,36.25 23.9,38.35 6.35,38.35 JP1.29
UDAT11
  Top 0.203: IC1.53 28.5,35.46 16.03,35.46 15.52,35.97 3.66,35.97 JP1.30
UDAT12
  Top 0.203: IC1.54 28.34,35.05 15.75,35.05 15.24,35.56 12.7,35.56 JP2.28
UDAT13
  Top 0.203: IC1.55 28.28,34.54 JP2.27
UDAT14
  Top 0.152: JP1.27 6.1,33.53 14.63,33.53 15.09,33.98 28.35,33.98 28.65,33.68 IC1.56
UDAT15  (via drill 0.25)
  Top 0.203: IC1.57 v19.31,33.27 v19.3,33.27
  Bottom 0.203: v19.3,33.27 3.81,33.27 JP1.28
UDAT16
  Top 0.203: IC1.60 28.65,31.09 15.14,31.09 JP2.25
UDAT17
  Top 0.203: IC1.61 28.86,30.73 12.95,30.73 JP2.26
UDAT18
  Top 0.203: IC1.62 28.16,29.46 JP2.23
UDAT19
  Top 0.203: IC1.63 28.21,28.96 17.02,28.96 16.51,28.19 12.95,28.19 JP2.24
UDAT20  (via drill 0.25)
  Top 0.203: IC1.64 28.02,28.19 v18.03,28.19
  Bottom 0.203: v18.03,28.19 6.1,28.19 5.08,29.21 JP1.23
UDAT21  (via drill 0.25)
  Top 0.203: IC1.65 28.08,27.69 27.18,27.69 v26.92,27.43
  Bottom 0.203: v26.92,27.43 25.4,25.91 4.06,25.91 JP1.20
UDAT22  (via drill 0.25)
  Top 0.203: IC1.66 28.13,27.18 27.69,27.18 v26.92,26.42
  Bottom 0.203: v26.92,26.42 25.91,25.4 6.1,25.4 JP1.19
UDAT23  (via drill 0.25)
  Top 0.203: IC1.67 v27.94,26.42
  Bottom 0.203: v27.94,26.42 24.64,23.11 6.35,23.11 JP1.17
UDAT24
  Top 0.203: IC1.69 28.31,25.65 12.95,25.65 JP2.20
UDAT25
  Top 0.203: IC1.70 27.6,24.38 JP2.19
UDAT26
  Top 0.203: IC1.71 26.9,23.11 12.95,23.11 JP2.18
UDAT27
  Top 0.203: IC1.72 26.19,21.84 JP2.17
UDAT28
  Top 0.203: IC1.73 25.49,20.57 12.95,20.57 JP2.16
UDAT29
  Top 0.203: IC1.74 24.79,19.3 JP2.15
UDAT30
  Top 0.203: IC1.75 24.08,18.03 12.95,18.03 JP2.14
UDAT31
  Top 0.203: IC1.76 23.38,16.76 JP2.13
V1REF  (via drill 0.25, 0.25 pad 0.25)
  Top 0.152: IC1.2 35.05,27.28 | 35.05,27.74 IC1.3
  Top 0.203: v34.95,28.5 34.95,27.88 IC1.3 35.24,27.47 35.05,27.28 | IC1.48 31.48,35.31 v32,35.31 34.04,37.34 | IC1.39 34.04,37.84 34.04,37.34 | 34.04,37.34 34.8,36.58 35.05,36.58 | 35.05,36.58 35.81,36.58 36.18,36.94 IC1.33 | IC1.30 36.52,35.56 36.07,35.56 35.05,36.58
  Bottom 0.203: 34.9,28.55 v34.95,28.5 | v34.95,28.5 34.92,28.47 | v34.95,28.5 33.83,29.62 C22.1 C15.2 | C15.2 | C15.2 32,31.04 v32,35.31
VBUS  (via drill 0.25)  (3 unrouted)
  Top 0.203: IC1.37 35.86,38.86 v36.07,38.86 | v45.21,43.43 45.27,43.49 U$4.8
  Bottom 0.203: v36.07,38.86 36.83,38.1 39.12,38.1 44.45,43.43 v45.21,43.43
  pour Top (isolate 0.254, rank 2): 44.96,47.75 48.51,47.75 49.53,46.74 52.32,46.74 52.32,42.42 44.96,42.42
WKPN  (3 unrouted)
WRN  (1 unrouted)